# Altium project door_clock_tkhtn_ver2.PrjPcb
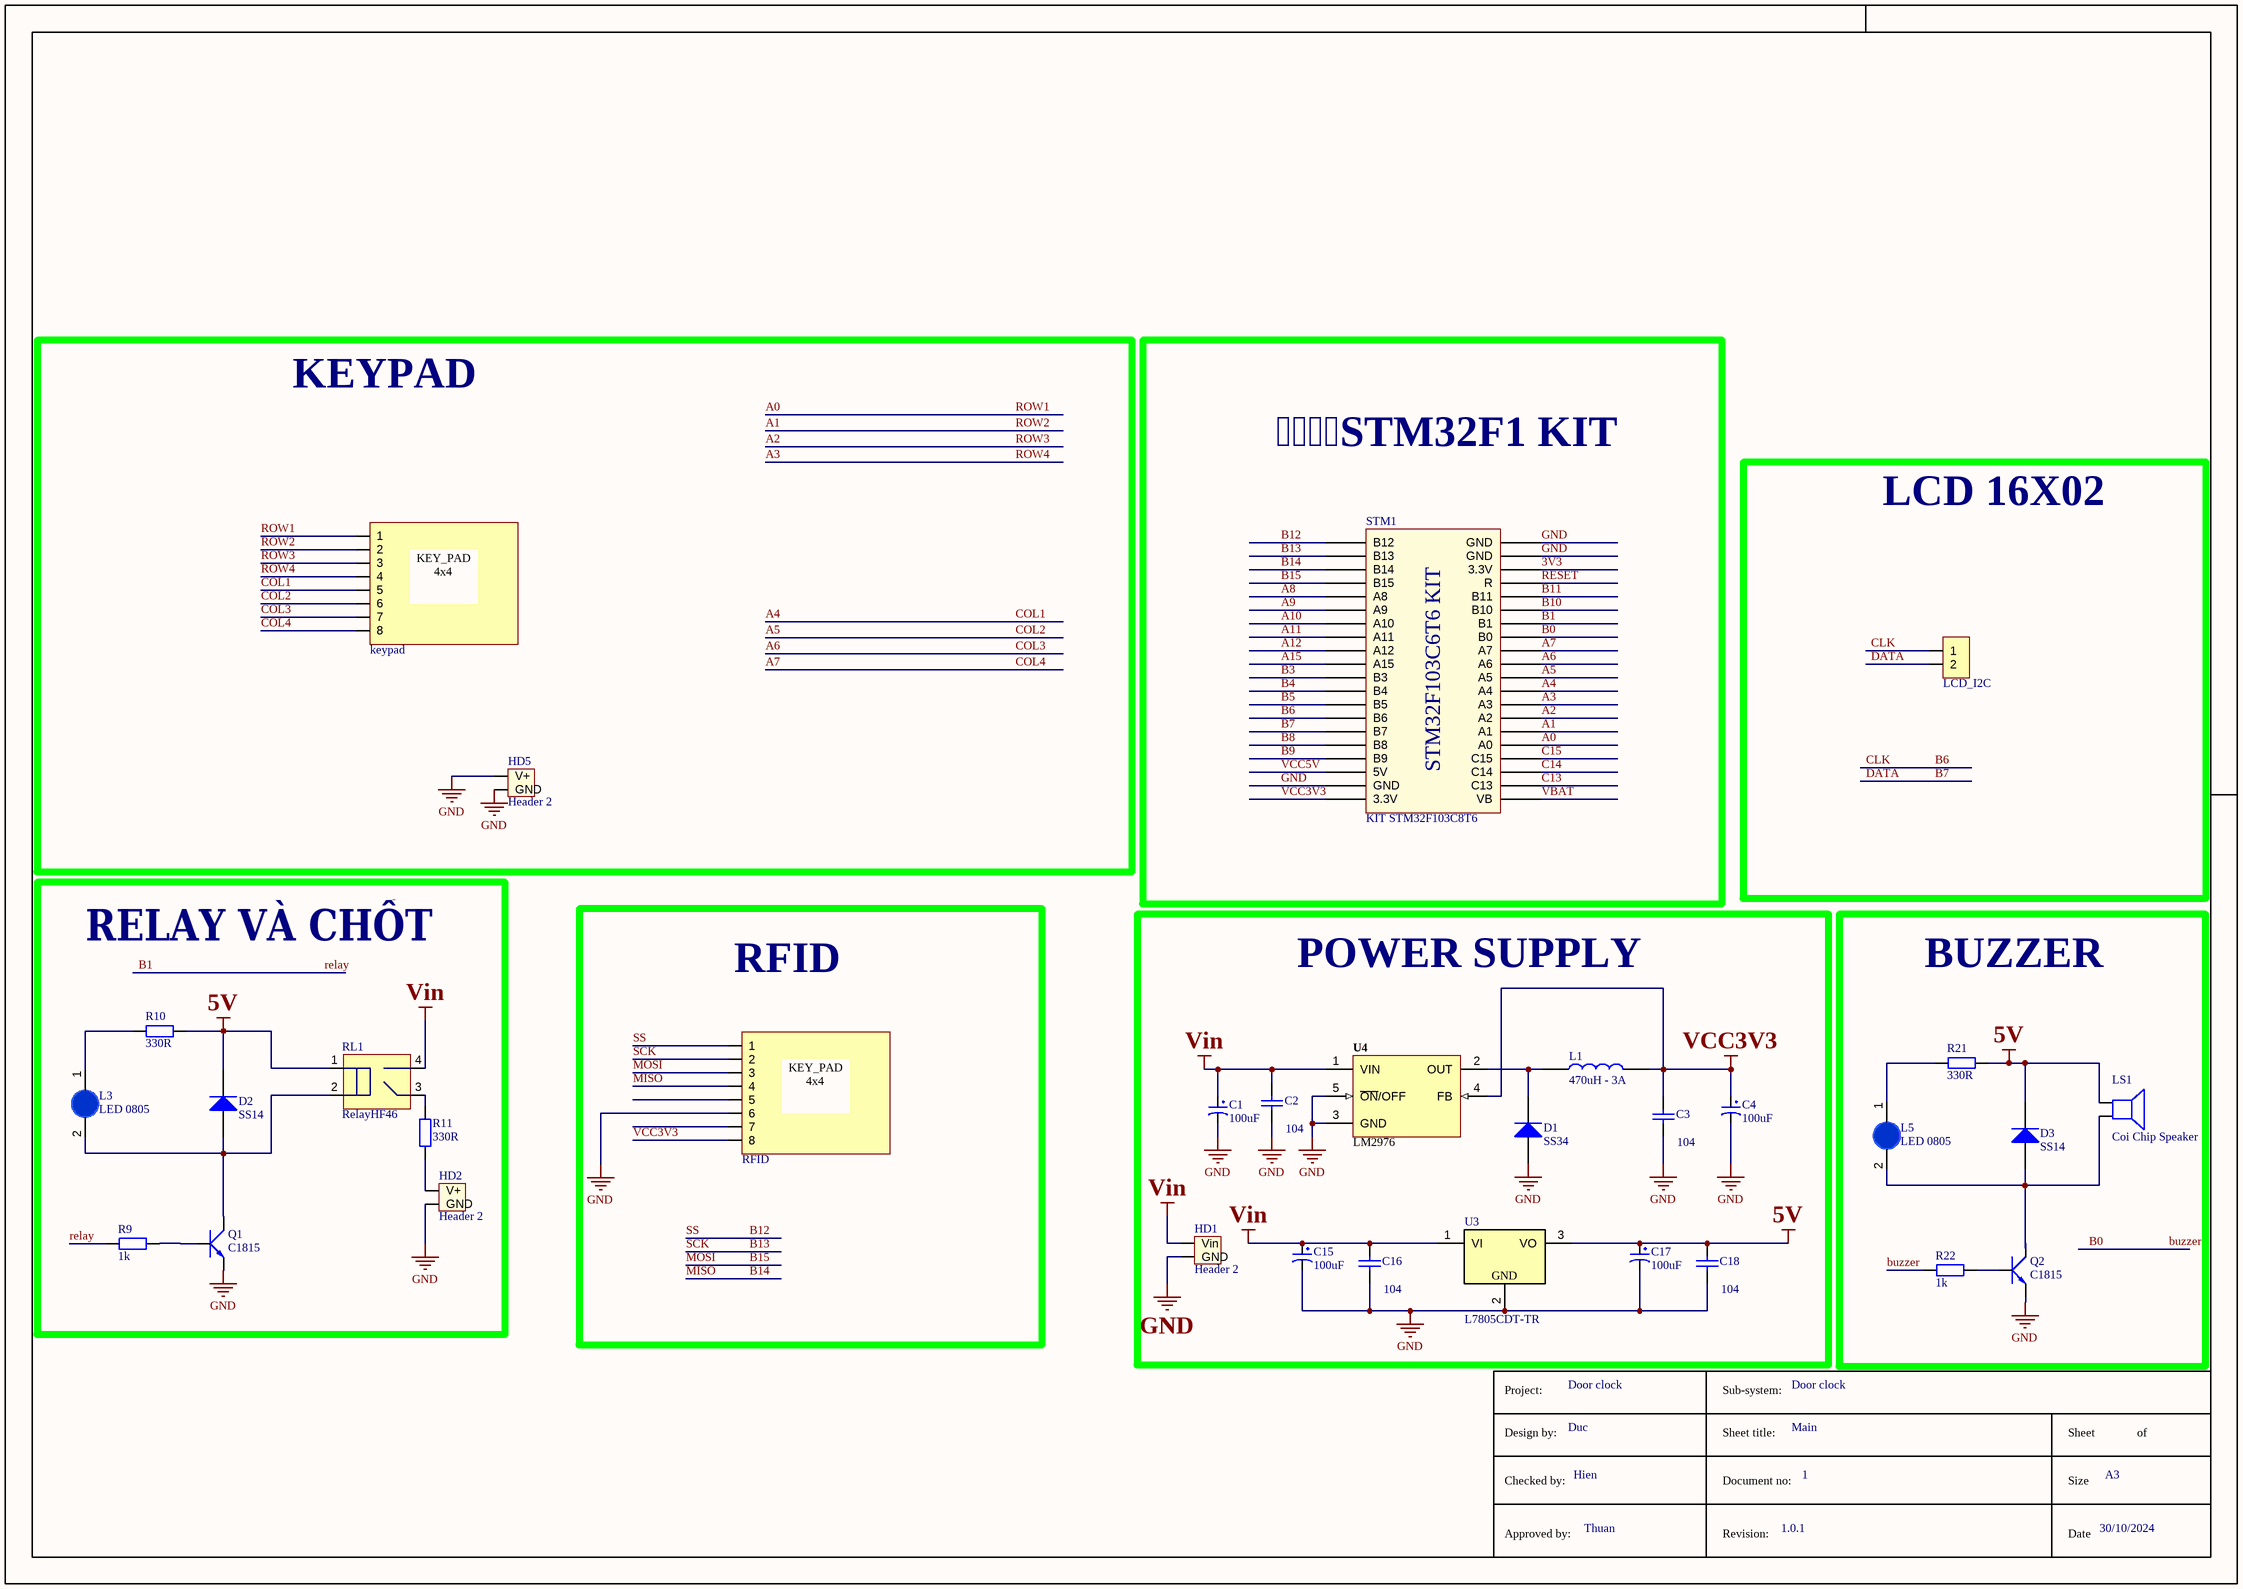
[diagram p0: door_clock_ver2.SchDoc]
1 sheet, 32 parts. Net scope: global (net labels, ports and power ports of the same name join across sheets).
Board file: door_clock_ver2.PcbDoc

## Sheet door_clock_ver2.SchDoc
size 420 x 297 mm; SheetNumber: 1; SheetTotal: 1

### Parts
C1  100uF  [tu hoa 8mm]
C2  104  [tu 0805]
C3  104  [tu 0805]
C4  100uF  [tu hoa 8mm]
C15  100uF  [tu hoa 8mm]
C16  104  [tu 0805]
C17  100uF  [tu hoa 8mm]
C18  104  [tu 0805]
D1  SS34  [DIODE SMA]
D2  SS14  [DIODE SMA]
D3  SS14  [DIODE SMA]
HD1  Header 2  [HED2]
HD2  Header 2  [HED2]
HD5  Header 2  [HED2]
JP25  keypad  [JP 1x8 DT]
JP26  RFID  [JP 1x8 DT]
JP27  LCD_I2C  [JP 1x2 DT]
L1  470uH - 3A  [CUON CAM 100uH3A]
L3  LED 0805  [LED-0805-Blue]
L5  LED 0805  [LED-0805-Blue]
LS1  Coi Chip Speaker  [Coi Chip Speacker]
Q1  C1815  [TO92]
Q2  C1815  [TO92]
R9  1k  [tro smd 0805]
R10  330R  [Tro SMD 0805]
R11  330R  [Tro SMD 0805]
R21  330R  [Tro SMD 0805]
R22  1k  [tro smd 0805]
RL1  RelayHF46  [Relay 4 chan HF46F]
STM1  KIT STM32F103C8T6  [STM32F103 KIT]
U3  L7805CDT-TR  [DPAK_118_446_112X59_SMD]
U4  LM2976  [TO263]

### Blocks framed on the sheet
KEYPAD: HD5 JP25
STM32F1 KIT: STM1
LCD 16X02: JP27
RELAY VÀ CHỐT: D2 HD2 L3 Q1 R9-R11 RL1
RFID: JP26
POWER SUPPLY: C1-C4 C15-C18 D1 HD1 L1 U3 U4
BUZZER: D3 L5 LS1 Q2 R21 R22

### Nets
5V: C17.1 C18.1 D2.2(K) D3.2(K) LS1.1 R10.2 R21.2 RL1.1 U3.3(VO)
GND: C1.2 C2.2 C3.2 C4.2 C15.2 C16.2 C17.2 C18.2 D1.1(A) HD1.2(GND) HD2.2(GND) HD5.1(V+) HD5.2(GND) JP26.6 Q1.1(E) Q2.1(E) STM1.19(GND) STM1.39(GND) STM1.40(GND) U3.2 U4.3(GND) U4.5(~{ON}/OFF)
VCC3V3: C3.1 C4.1 JP26.8 L1.2 STM1.20(3.3V) U4.4(FB)
Vin: C1.1 C2.1 C15.1 C16.1 HD1.1(Vin) RL1.4(AC/DC) U3.1(VI) U4.1(VIN)
3V3: STM1.38(3.3V)
A0: JP25.1 STM1.25(A0)  [also labelled ROW1]
A1: JP25.2 STM1.26(A1)  [also labelled ROW2]
A2: JP25.3 STM1.27(A2)  [also labelled ROW3]
A3: JP25.4 STM1.28(A3)  [also labelled ROW4]
A4: JP25.5 STM1.29(A4)  [also labelled COL1]
A5: JP25.6 STM1.30(A5)  [also labelled COL2]
A6: JP25.7 STM1.31(A6)  [also labelled COL3]
A7: JP25.8 STM1.32(A7)  [also labelled COL4]
A8: STM1.5(A8)
A9: STM1.6(A9)
A10: STM1.7(A10)
A11: STM1.8(A11)
A12: STM1.9(A12)
A15: STM1.10(A15)
B0: R22.1 STM1.33(B0)  [also labelled buzzer]
B1: R9.1 STM1.34(B1)  [also labelled relay]
B3: STM1.11(B3)
B4: STM1.12(B4)
B5: STM1.13(B5)
B6: JP27.1 STM1.14(B6)  [also labelled CLK]
B7: JP27.2 STM1.15(B7)  [also labelled DATA]
B8: STM1.16(B8)
B9: STM1.17(B9)
B10: STM1.35(B10)
B11: STM1.36(B11)
B12: JP26.1 STM1.1(B12)  [also labelled SS]
B13: JP26.2 STM1.2(B13)  [also labelled SCK]
B14: JP26.4 STM1.3(B14)  [also labelled MISO]
B15: JP26.3 STM1.4(B15)  [also labelled MOSI]
C13: STM1.22(C13)
C14: STM1.23(C14)
C15: STM1.24(C15)
RESET: STM1.37(R)
VBAT: STM1.21(VB)
VCC5V: STM1.18(5V)
NetD1_2: D1.2(K) L1.1 U4.2(OUT)
NetD2_1: D2.1(A) L3.2(K) Q1.2(C) RL1.2
NetD3_1: D3.1(A) L5.2(K) LS1.2 Q2.2(C)
NetHD2_1: HD2.1(V+) R11.1
NetL3_1: L3.1(A) R10.1
NetL5_1: L5.1(A) R21.1
NetQ1_3: Q1.3(B) R9.2
NetQ2_3: Q2.3(B) R22.2
NetR11_2: R11.2 RL1.3(AC/DC)

Not connected (* = marked no-connect by the designer): JP26 5 7

### Notes on the sheet
- Project:
- Door clock
- Sub-system:
- Design by:
- Duc
- Sheet title:
- Main
- Sheet
- of
- Checked by:
- Approved by:
- Hien
- Thuan
- Document no:
- Revision:
- 1.0.1
- 1
- Size
- Date
- 30/10/2024
- A3
- (in symbol JP 1x8 2.54 Duc Thang) KEY_PAD 4x4
- (in symbol REG_35V_5V-1.5A-7.5W-DPAK) GND
- (in symbol STM32f103 Bluepill) STM32F103C6T6 KIT

### Library data of the parts
C1 C4 C15 C17 = Tu Hoa 100uF 50V 8x11: Cắm; Don_Vi: Con; So_Chan: 2; Ten_Linh_Kien: Tụ Hóa 100uF 50V 8x11MM; Ma_Hang: MH006872; Chung_Loai: Cắm; Kieu_Chan: *
C2 C3 C16 C18 = Tu 0805 104 50V 10%: Dán; Don_Vi: Con; So_Chan: 2; Ten_Linh_Kien: Tụ 0805 104-100nF 10% 50V; Ma_Hang: MH004551; Chung_Loai: Dán; Kieu_Chan: *
D1 = Diode SS34 ( 1N5822 ): Dán; Don_Vi: Con; Ma_Hang: MH002104; Ten_Linh_Kien: Diode SS34 3A 40V SMA ( 1N5822 SS34A); Kieu_Chan: *; Chung_Loai: Dán
D2 D3 = Diode SS14 ( 1N5819): Dán; Ma_Hang: MH002211; Don_Vi: Con; Ten_Linh_Kien: Diode SS14 DO214 Schottky 1A 40V ( 1N5819 DO214); Chung_Loai: Dán; Ghi_Chu: *; Kieu_Chan: *
HD1 HD2 HD5 = Hed2: Header 2 (Green); Value: Header 2
JP25 JP26 = JP 1x8 2.54 Duc Thang: Cắm; Ten_Linh_Kien: Jump Đơn Đực 2.54MM 1x40P Thẳng 11MM; Don_Vi: Con; Ma_Hang: MH000903; Ghi_Chu: *; Kieu_Chan: *; Chung_Loai: Cắm
JP27 = JP 1x2 2.54 Duc Thang: Cắm; Ten_Linh_Kien: Jump Đơn Đực 2.54MM 1x40P Thẳng 11MM; Don_Vi: Con; Ma_Hang: MH000903; Ghi_Chu: *; Kieu_Chan: *; Chung_Loai: Cắm
L1 = CUON CAM 470uH DIP: Cắm; Don_Vi: Con; Ma_Hang: MH002232; Ten_Linh_Kien: Cuộn Cảm 470uH 3A 8x10MM; Ghi_Chu: *; Kieu_Chan: *; Chung_Loai: Cắm
L3 L5 = LED 0805 Xanh Duong: Dán; Don_Vi: Con; Ma_Hang: MH002327; Ten_Linh_Kien: LED 0805 Màu Xanh Dương (Blue); Ghi_Chu: *; Kieu_Chan: *; Chung_Loai: Dán
LS1 = Coi Chip Speaker: Còi chip
Q1 Q2 = Trans C1815 DIP: NPN transistor; Value: C9014
R9 R22 = Tro 0805 1% 1k: Dán; Don_Vi: Con; So_Chan: 2; Ten_Linh_Kien: Trở 0805 1% 1k; Ma_Hang: MH005468; Chung_Loai: Dán; Kieu_Chan: *
R10 R11 R21 = Tro 0805 5% 330R: Dán; Don_Vi: Con; So_Chan: 2; Ten_Linh_Kien: Trở 0805 5% 330R; Ma_Hang: MH005337; Chung_Loai: Dán; Kieu_Chan: *
RL1 = Relay 4 chan HF46F: Ten: Relay 5V5A HF46F-G 5-HS1; Ma_Hang: MH003879
STM1 = STM32f103 Bluepill: KIT STM32F103C8T6 Bluepill
U3 = REG_35V_5V-1.5A-7.5W-DPAK: Linear Voltage Regulator IC 1 Output 1.5A DPAK; Manufacturer: Diodes; Alternate Part Number-1: CJ7805 3%; Manufacturer Part Number: L7805CDT-TR; Case/Package: DPAK; Supplier-1: SP ROAD; Supplier Part Number-1: L7805CDT-TR
U4 = LM2596: Max Input Voltage: 12 V; Max Output Current: 3 (6.0 peak) A; Max Output Voltage: mV; Category: IC-Power; Min Input Voltage: mV; Min Output Voltage: mV; Mounting Technology: Surface Mount; Status: Unreleased; Supply Voltage: mV; Temperature Range: -40 to +125 degC